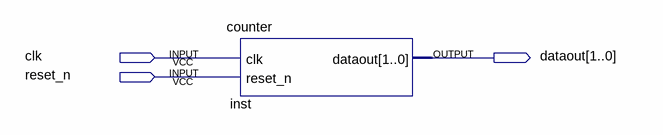
[diagram p0: schematic sheet]
// Quartus schematic chip_counter.bdf as structural Verilog: 1 symbols, 3 pins
module chip_counter (
  input  clk,
  input  reset_n,
  output [1:0] dataout
);

  counter inst (.clk(clk), .reset_n(reset_n), .dataout(dataout));
endmodule
